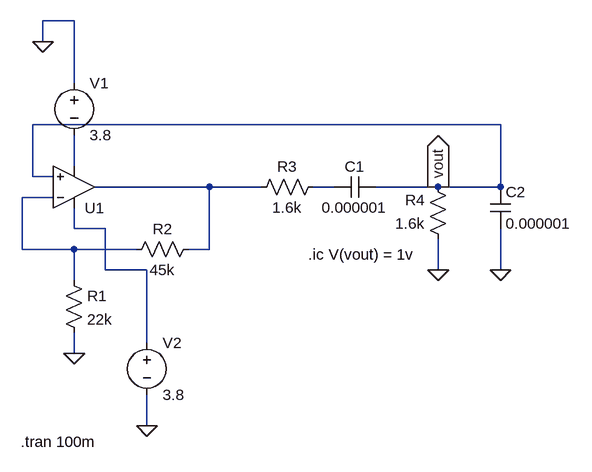
[diagram p0: schematic Draft7.asc]
Draft7.asc, the LTspice schematic file:
Version 4
SHEET 1 1096 680
WIRE 320 -64 272 -64
WIRE 272 -32 272 -64
WIRE 320 32 320 -64
WIRE 976 96 256 96
WIRE 320 160 320 112
WIRE 256 176 256 96
WIRE 288 176 256 176
WIRE 528 192 352 192
WIRE 608 192 528 192
WIRE 720 192 688 192
WIRE 880 192 784 192
WIRE 976 192 976 96
WIRE 976 192 880 192
WIRE 288 208 240 208
WIRE 976 208 976 192
WIRE 320 256 320 224
WIRE 368 256 320 256
WIRE 240 288 240 208
WIRE 320 288 240 288
WIRE 416 288 320 288
WIRE 528 288 528 192
WIRE 528 288 496 288
WIRE 368 320 368 256
WIRE 432 320 368 320
WIRE 880 320 880 272
WIRE 976 320 976 256
WIRE 320 336 320 288
WIRE 432 432 432 320
WIRE 320 448 320 416
WIRE 432 560 432 512
FLAG 432 560 0
FLAG 320 448 0
FLAG 880 320 0
FLAG 976 320 0
FLAG 272 -32 0
FLAG 880 192 vout
IOPIN 880 192 Out
SYMBOL voltage 320 16 R0
WINDOW 123 0 0 Left 0
WINDOW 39 0 0 Left 0
SYMATTR InstName V1
SYMATTR Value 3.8
SYMBOL voltage 432 416 R0
WINDOW 123 0 0 Left 0
WINDOW 39 0 0 Left 0
SYMATTR InstName V2
SYMATTR Value 3.8
SYMBOL res 304 320 R0
SYMATTR InstName R1
SYMATTR Value 22k
SYMBOL res 512 272 R90
WINDOW 0 0 56 VBottom 2
WINDOW 3 32 56 VTop 2
SYMATTR InstName R2
SYMATTR Value 45k
SYMBOL res 704 176 R90
WINDOW 0 0 56 VBottom 2
WINDOW 3 32 56 VTop 2
SYMATTR InstName R3
SYMATTR Value 1.6k
SYMBOL res 896 288 R180
WINDOW 0 36 76 Left 2
WINDOW 3 36 40 Left 2
SYMATTR InstName R4
SYMATTR Value 1.6k
SYMBOL OpAmps\\UniversalOpamp2 320 192 M180
SYMATTR InstName U1
SYMBOL cap 784 176 R90
WINDOW 0 0 32 VBottom 2
WINDOW 3 32 32 VTop 2
SYMATTR InstName C1
SYMATTR Value 0.000001
SYMBOL cap 960 192 R0
SYMATTR InstName C2
SYMATTR Value 0.000001
TEXT 238 584 Left 2 !.tran 100m
TEXT 680 296 Left 2 !.ic V(vout) = 1v

The netlist it stands for:
* Draft7.asc
V1 0 N001 3.8
V2 N005 0 3.8
R1 N004 0 22k
R2 N002 N004 45k
R3 N003 N002 1.6k
R4 0 vout 1.6k
XU1 vout N004 N005 N001 N002 level.2 Avol=1Meg GBW=10Meg Slew=10Meg ilimit=25m rail=0 Vos=0 phimargin=45 en=0 enk=0 in=0 ink=0 Rin=500Meg  ; pins IN+ IN- V+ V- OUT
C1 vout N003 0.000001
C2 vout 0 0.000001
.tran 100m
.ic V(vout) = 1v
.lib UniversalOpamps2.sub
.backanno
.end